# EAGLE design mphase (EAGLE 9.6.2)
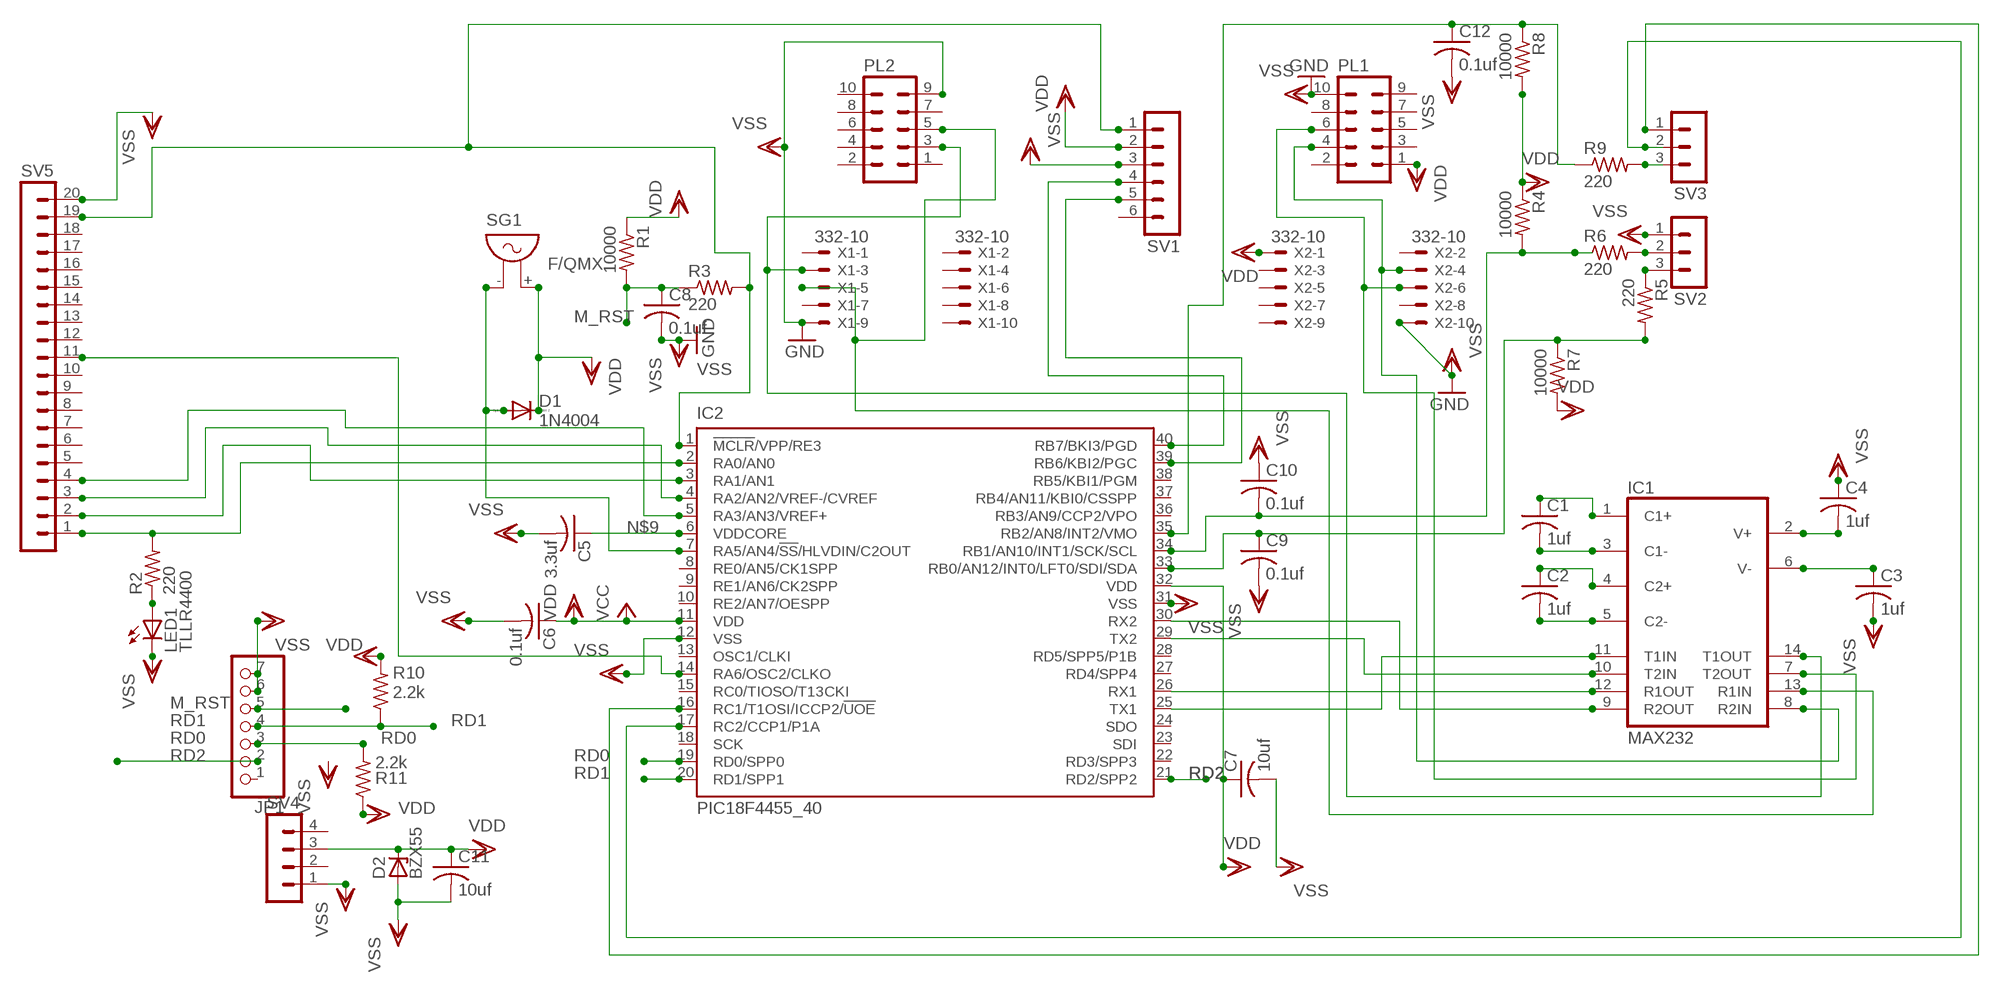
[diagram p0: schematic, sheet 1]

## Parts
C1  1uf  C-USC1206  [C1206]
C2  1uf  C-USC1206  [C1206]
C3  1uf  C-USC1206  [C1206]
C4  1uf  C-USC1206  [C1206]
C5  3.3uf  C-USC1206  [C1206]
C6  0.1uf  C-USC1206  [C1206]
C7  10uf  C-USC1206  [C1206]
C8  0.1uf  C-USC1206  [C1206]
C9  0.1uf  C-USC1206  [C1206]
C10  0.1uf  C-USC1206  [C1206]
C11  10uf  C-USC1206  [C1206]
C12  0.1uf  C-USC1206  [C1206]
D1  1N4004  [DO41-10]
D2  BZX55  [DO35Z10]
IC1  MAX232  [DIL16]
IC2  PIC18F4455_40  [DIL40]
JP1  PINHD-1X7  [1X07]
LED1  TLLR4400  [LED3MM]
PL1  10H  [10H]
PL2  10H  [10H]
R1  10000  R-US_0204/2V  [0204V]
R2  220  R-US_0204/2V  [0204V]
R3  220  R-US_0204/2V  [0204V]
R4  10000  R-US_0204/2V  [0204V]
R5  220  R-US_0204/2V  [0204V]
R6  220  R-US_0204/2V  [0204V]
R7  10000  R-US_0204/2V  [0204V]
R8  10000  R-US_0204/2V  [0204V]
R9  220  R-US_0204/2V  [0204V]
R10  2.2k  R-US_0204/2V  [0204V]
R11  2.2k  R-US_0204/2V  [0204V]
SG1  F/QMX  [F/QMX]
SV1  MA06-1  [MA06-1]
SV2  MA03-1  [MA03-1]
SV3  MA03-1  [MA03-1]
SV4  MA04-1  [MA04-1]
SV5  MA20-1  [MA20-1]
X1  332-10  [332-10]
X2  332-10  [332-10]

## Nets
M_RST: C8.1 JP1.5 R1.2 R3.1
N$1: C1.2 IC1.3(C1-)
N$2: C2.2 IC1.5(C2-)
N$3: C2.1 IC1.4(C2+)
N$4: C1.1 IC1.1(C1+)
N$5: C4.2 IC1.2(V+)
N$6: C3.1 IC1.6(V-)
N$7: D1.A IC2.7(RA5/AN4/!SS!/HLVDIN/C2OUT) SG1.-
N$8: IC2.1(!MCLR!/VPP/RE3) R3.2 SV1.1 SV5.19
N$9: C5.1 IC2.6(VDDCORE)
N$10: IC1.10(T2IN) IC2.29(TX2)
N$11: IC1.11(T1IN) IC2.25(TX1)
N$12: IC1.12(R1OUT) IC2.26(RX1)
N$13: IC1.9(R2OUT) IC2.30(RX2)
N$15: IC2.2(RA0/AN0) R2.2 SV5.1
N$16: IC1.7(T2OUT) PL1.6 X2.6
N$17: IC1.8(R2IN) PL1.4 X2.4
N$18: LED1.A R2.1
N$19: IC1.14(T1OUT) PL2.3 X1.3
N$20: IC1.13(R1IN) PL2.5 X1.5
N$21: C10.2 IC2.34(RB1/AN10/INT1/SCK/SCL) R4.2 R6.1
N$22: C9.1 IC2.33(RB0/AN12/INT0/LFT0/SDI/SDA) R5.2 R7.1
N$23: IC2.3(RA1/AN1) SV5.2
N$24: R6.2 SV2.2
N$25: R5.1 SV2.3
N$26: IC2.4(RA2/AN2/VREF-/CVREF) SV5.3
N$27: IC2.5(RA3/AN3/VREF+) SV5.4
N$28: C12.1 IC2.35(RB2/AN8/INT2/VMO) R8.1 R9.1
N$29: IC2.40(RB7/BKI3/PGD) SV1.4
N$30: IC2.14(RA6/OSC2/CLKO) SV5.11
N$31: R9.2 SV3.3
N$32: IC2.39(RB6/KBI2/PGC) SV1.5
N$33: IC2.16(RC1/T1OSI/ICCP2/!UOE) SV3.1
N$34: IC2.17(RC2/CCP1/P1A) SV3.2
RD0: IC2.19(RD0/SPP0) JP1.3 R11.2
RD1: IC2.20(RD1/SPP1) JP1.4 R10.1
RD2: IC2.21(RD2/SPP2) JP1.2
VCC: C6.1 IC2.11(VDD) ; supply symbol labelled VDD
VDD: C7.1 C11.1 D1.C D2.C IC2.32(VDD) PL1.1 R1.1 R4.1 R7.2 R8.2 R10.2 R11.1 SG1.+ SV1.2 SV4.3 X2.1
VSS: C3.2 C4.1 C5.2 C6.2 C7.2 C8.2 C9.2 C10.1 C11.2 C12.2 D2.A IC2.12(VSS) IC2.31(VSS) JP1.6 JP1.7 LED1.K(C) PL1.10 PL2.9 SV1.3 SV2.1 SV4.1 SV5.20 X1.9 X2.10 ; supply symbol labelled GND
Unconnected: IC2.8(RE0/AN5/CK1SPP) IC2.9(RE1/AN6/CK2SPP) IC2.10(RE2/AN7/OESPP) IC2.13(OSC1/CLKI) IC2.15(RC0/TIOSO/T13CKI) IC2.18(SCK) IC2.22(RD3/SPP3) IC2.23(SDI) IC2.24(SDO) IC2.27(RD4/SPP4) IC2.28(RD5/SPP5/P1B) IC2.36(RB3/AN9/CCP2/VPO) IC2.37(RB4/AN11/KBI0/CSSPP) IC2.38(RB5/KBI1/PGM) JP1.1 PL1.2 PL1.3 PL1.5 PL1.7 PL1.8 PL1.9 PL2.1 PL2.2 PL2.4 PL2.6 PL2.7 PL2.8 PL2.10 SV1.6 SV4.2 SV4.4 SV5.5 SV5.6 SV5.7 SV5.8 SV5.9 SV5.10 SV5.12 SV5.13 SV5.14 SV5.15 SV5.16 SV5.17 SV5.18 X1.1 X1.2 X1.4 X1.6 X1.7 X1.8 X1.10 X2.2 X2.3 X2.5 X2.7 X2.8 X2.9

## Power pins joined to a net without a drawn wire
VCC: IC1.16(VCC)
VSS: IC1.15(GND)

## Library data of the parts
C1-C12 = rcl:C-US: CAPACITOR, American symbol; SPICEPREFIX: C
D1 = diode:1N4004: DIODE general purpose rectifier, 1 A
D2 = diode:BZX55: Z DIODE
IC1 = maxim:MAX232: RS232 TRANSCEIVER; MF: MAXIM; MPN: MAX232ACPE+; OC_FARNELL: 9723773; OC_NEWARK: 68K4544
IC2 = microchip:PIC18F4*_40: USB Microcontrollers with nanoWatt Technology High-Performance, Enhanced Flash, 28/40/44-Pin, Source: http://ww1.microchip.com/downloads/en/devicedoc/39632c.pdf; MF: MICROCHIP; MPN: PIC18F45K80; OC_FARNELL: 9321314; OC_NEWARK: 05K2028
JP1 = pinhead:PINHD-1X7: PIN HEADER
LED1 = led:TLLR4400: Low Current (2mA) LED 3 mm Tinted Diffused Package color RED Source: Data sheet <http://www.farnell.com/datasheets/391100.pdf>; MF: VISHAY SEMICONDUCTOR; OC_FARNELL: 1612437
PL1 PL2 = con-harting-h:10H: CONNECTOR; OC_FARNELL: unknown; OC_NEWARK: unknown
R1-R11 = resistor:R-US_: RESISTOR, American symbol
SG1 = buzzer:F/QMX: BUZZER Source: Buerklin; OC_FARNELL: unknown; OC_NEWARK: unknown
SV1 = con-lstb:MA06-1: PIN HEADER; OC_FARNELL: unknown; OC_NEWARK: unknown
SV2 SV3 = con-lstb:MA03-1: PIN HEADER; OC_FARNELL: unknown; OC_NEWARK: unknown
SV4 = con-lstb:MA04-1: PIN HEADER; OC_FARNELL: unknown; OC_NEWARK: unknown
SV5 = con-lstb:MA20-1: PIN HEADER; OC_FARNELL: unknown; OC_NEWARK: unknown
X1 X2 = con-garry:332-10: 10 Pin - 2mm Dual Row Source: www.mpe-connector.de / garry_shortform_2012.pdf

## Board
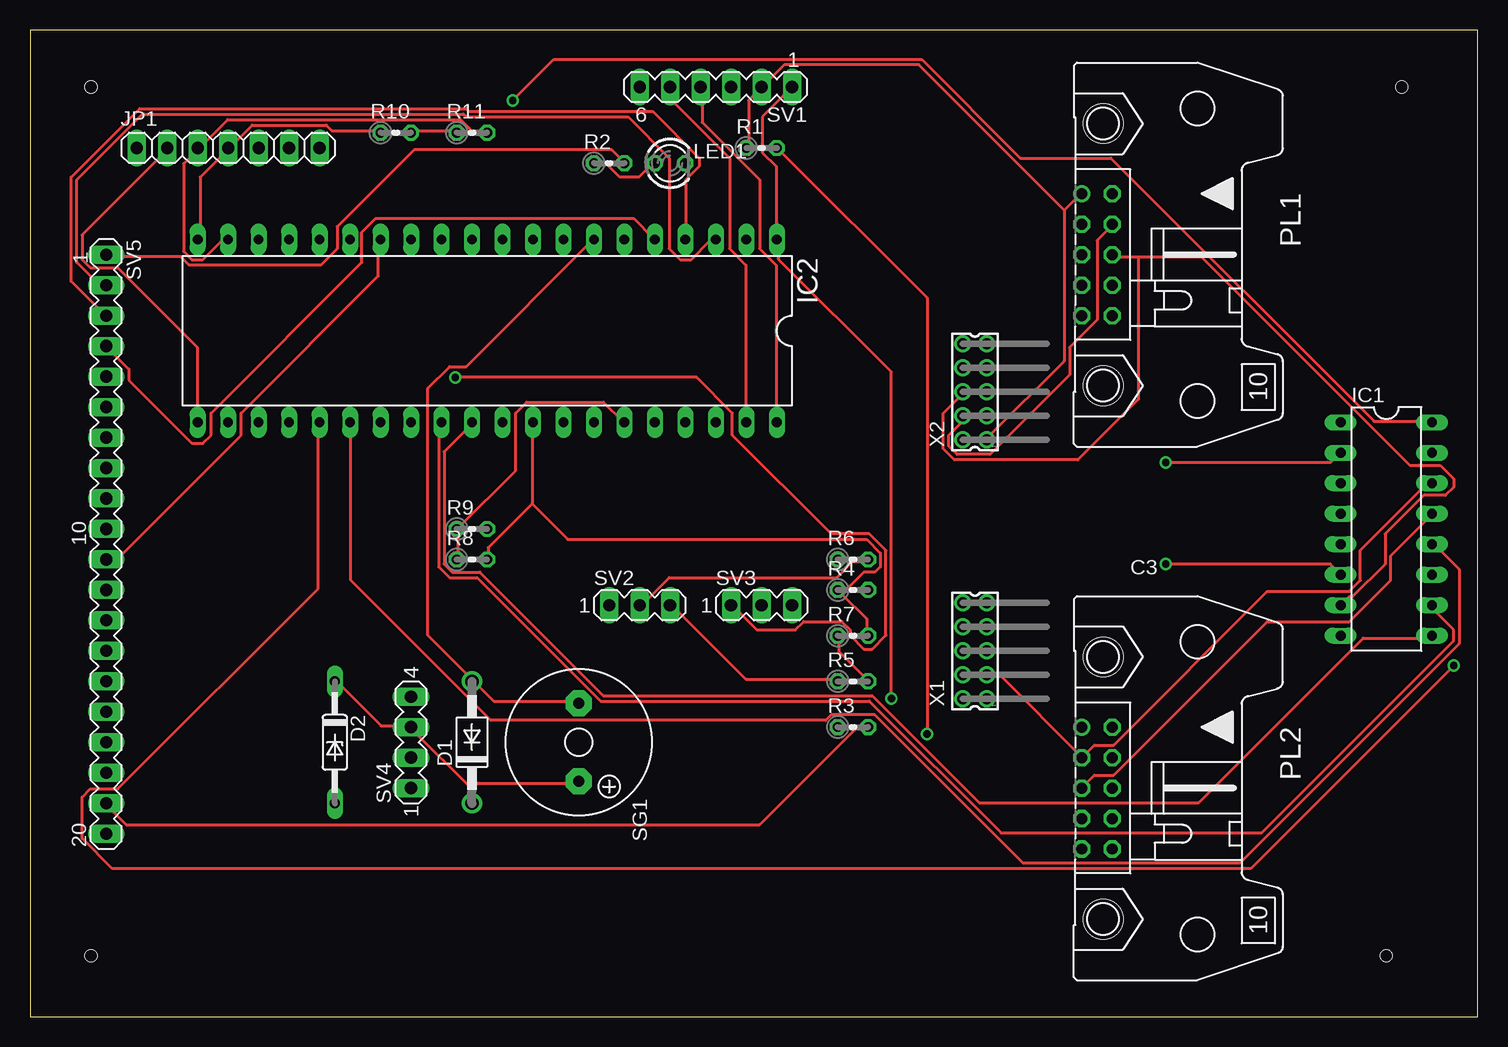
[diagram p1: board, top side]
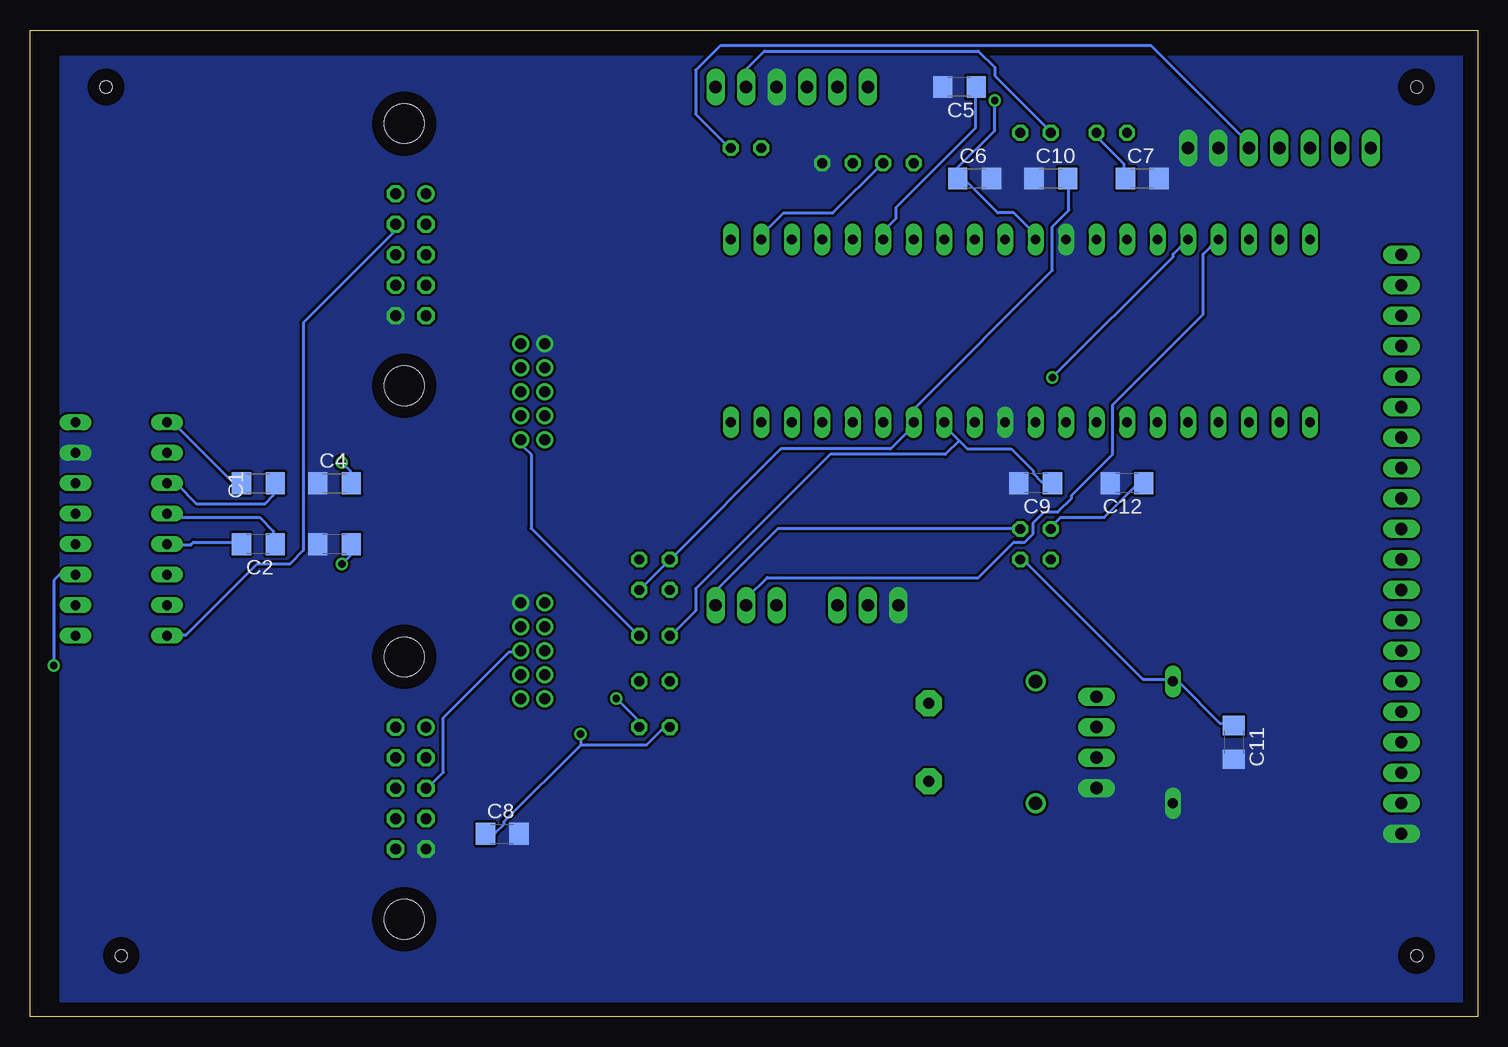
[diagram p2: board, bottom side, seen from below]

Size 120.63 x 82.22 mm. Coordinates in mm from the lower left corner, seen from the top.
Outline: 0,0 120.63,0 120.63,82.22 0,82.22 0,0
Copper layers (1*16): Top 0.035mm / dielectric 1.5mm / Bottom 0.035mm
Design rules "default": minimum track width 10mil, minimum drill 24mil, track to track 8mil, track to pad 8mil, pad to pad 8mil, via to via 8mil, smd to smd 8mil, copper to edge 40mil, drill to drill 8mil, minimum pad ring 10mil, minimum via ring 8mil, stop-mask expansion 4mil, vias tented up to drill 0mil, thermal gap 10mil
Holes 1 mm at 5.08,77.47 5.08,5.08 113.03,5.08 114.3,77.47

### Footprints (pad centres in the part's own frame; a part is rotated, then mirrored left to right if it is on the bottom)
C1206 = smd 1.6 x 1.8: 1 -1.4,0; 2 1.4,0
DO41-10 = drill 1.118: A 5.08,0; C -5.08,0
DO35Z10 = drill 0.813 long: A 5.08,0; C -5.08,0
DIL16 = drill 0.813 long: 1 -8.89,-3.81; 2 -6.35,-3.81; 3 -3.81,-3.81; 4 -1.27,-3.81; 5 1.27,-3.81; 6 3.81,-3.81; 7 6.35,-3.81; 8 8.89,-3.81; 9 8.89,3.81; 10 6.35,3.81; 11 3.81,3.81; 12 1.27,3.81; 13 -1.27,3.81; 14 -3.81,3.81; 15 -6.35,3.81; 16 -8.89,3.81
DIL40 = drill 0.813 long: 1 -24.13,-7.62; 2 -21.59,-7.62; 3 -19.05,-7.62; 4 -16.51,-7.62; 5 -13.97,-7.62; 6 -11.43,-7.62; 7 -8.89,-7.62; 8 -6.35,-7.62; 9 -3.81,-7.62; 10 -1.27,-7.62; 11 1.27,-7.62; 12 3.81,-7.62; 13 6.35,-7.62; 14 8.89,-7.62; 15 11.43,-7.62; 16 13.97,-7.62; 17 16.51,-7.62; 18 19.05,-7.62; 19 21.59,-7.62; 20 24.13,-7.62; 21 24.13,7.62; 22 21.59,7.62; 23 19.05,7.62; 24 16.51,7.62; 25 13.97,7.62; 26 11.43,7.62; 27 8.89,7.62; 28 6.35,7.62; 29 3.81,7.62; 30 1.27,7.62; 31 -1.27,7.62; 32 -3.81,7.62; 33 -6.35,7.62; 34 -8.89,7.62; 35 -11.43,7.62; 36 -13.97,7.62; 37 -16.51,7.62; 38 -19.05,7.62; 39 -21.59,7.62; 40 -24.13,7.62
1X07 = drill 1.016 long: 1 -7.62,0; 2 -5.08,0; 3 -2.54,0; 4 0,0; 5 2.54,0; 6 5.08,0; 7 7.62,0
LED3MM = drill 0.813 octagon: A -1.27,0; K 1.27,0
10H = drill 0.914: 1 -5.08,-1.27 | drill 0.914 octagon: 2 -5.08,1.27; 3 -2.54,-1.27; 4 -2.54,1.27; 5 0,-1.27; 6 0,1.27; 7 2.54,-1.27; 8 2.54,1.27; 9 5.08,-1.27; 10 5.08,1.27 | hole 3.302: -10.922,0.533; 10.922,0.533
0204V = drill 0.813 octagon: 1 -1.27,0; 2 1.27,0
F/QMX = drill 0.914 pad 2.159 octagon: + 3.251,0; - -3.251,0
MA06-1 = drill 1.016 long: 1 -6.35,0; 2 -3.81,0; 3 -1.27,0; 4 1.27,0; 5 3.81,0; 6 6.35,0
MA03-1 = drill 1.016 long: 1 -2.54,0; 2 0,0; 3 2.54,0
MA04-1 = drill 1.016 long: 1 -3.81,0; 2 -1.27,0; 3 1.27,0; 4 3.81,0
MA20-1 = drill 1.016 long: 1 -24.13,0; 2 -21.59,0; 3 -19.05,0; 4 -16.51,0; 5 -13.97,0; 6 -11.43,0; 7 -8.89,0; 8 -6.35,0; 9 -3.81,0; 10 -1.27,0; 11 1.27,0; 12 3.81,0; 13 6.35,0; 14 8.89,0; 15 11.43,0; 16 13.97,0; 17 16.51,0; 18 19.05,0; 19 21.59,0; 20 24.13,0
332-10 = drill 0.9 pad 1.27: 1 -4,-1; 2 -4,1; 3 -2,-1; 4 -2,1; 5 0,-1; 6 0,1; 7 2,-1; 8 2,1; 9 4,-1; 10 4,1

### Placement (x,y rotation side)
C1  101.6,44.45 0 bottom
C2  101.6,39.37 180 bottom
C3  95.25,39.37 180 bottom
C4  95.25,44.45 0 bottom
C5  43.18,77.47 180 bottom
C6  41.91,69.85 0 bottom
C7  27.94,69.85 0 bottom
C8  81.28,15.24 0 bottom
C9  36.83,44.45 180 bottom
C10  35.56,69.85 0 bottom
C11  20.32,22.86 270 bottom
C12  29.21,44.45 180 bottom
D1  36.83,22.86 90 top
D2  25.4,22.86 270 top
IC1  113.03,40.64 270 top
IC2  38.1,57.15 180 top
JP1  16.51,72.39 0 top
LED1  53.34,71.12 0 top
PL1  88.9,63.5 270 top
PL2  88.9,19.05 270 top
R1  60.96,72.39 0 top
R2  48.26,71.12 0 top
R3  68.58,24.13 0 top
R4  68.58,35.56 0 top
R5  68.58,27.94 0 top
R6  68.58,38.1 0 top
R7  68.58,31.75 0 top
R8  36.83,38.1 0 top
R9  36.83,40.64 0 top
R10  30.48,73.66 0 top
R11  36.83,73.66 0 top
SG1  45.72,22.86 270 top
SV1  57.15,77.47 180 top
SV2  50.8,34.29 0 top
SV3  60.96,34.29 0 top
SV4  31.75,22.86 90 top
SV5  6.35,39.37 270 top
X1  78.74,30.48 90 top
X2  78.74,52.07 90 top

### Tracks (layer width: path | path; a pad name or v marks a point on that pad's centre or on a via)
M_RST  (via drill 0.61)
  Top 0.254: v74.75,23.55 74.75,59.89 62.41,72.24 R1.2
  Bottom 0.254: 74.75,22.63 81.15,16.23 81.15,16 81.84,15.32 82.53,15.32 C8.1 | 74.75,22.63 69.27,22.63 67.89,24 67.44,24 R3.1 | R1.2 62.41,72.47 65.15,75.21 65.15,78.87 63.09,80.92 27.2,80.92 19.2,72.92 19.2,72.47 JP1.5 | v74.75,23.55 74.75,22.63
N$1
  Bottom 0.254: C1.2 100.36,44.35 100.36,43.43 101.04,42.75 106.76,42.75 108.36,44.35 109.04,44.35 IC1.3
N$2
  Bottom 0.254: C2.2 103.1,39.55 106.98,39.55 107.21,39.32 109.04,39.32 IC1.5
N$3
  Bottom 0.254: C2.1 100.36,39.55 100.36,40.46 101.5,41.6 108.81,41.6 109.04,41.83 IC1.4
N$4
  Bottom 0.254: C1.1 103.1,44.58 103.78,44.58 108.58,49.38 109.04,49.38 IC1.1
N$5  (via drill 0.61)
  Top 0.254: v94.64,46.18 108.36,46.18 109.04,46.86 IC1.2
  Bottom 0.254: v94.64,46.18 93.95,45.49 93.95,44.58 C4.2
N$6  (via drill 0.61)
  Top 0.254: v94.64,37.72 108.36,37.72 109.04,37.03 IC1.6
  Bottom 0.254: v94.64,37.72 93.95,38.41 93.95,39.32 C3.1
N$7
  Top 0.254: IC2.7 46.86,64.69 36.35,54.18 34.98,54.18 33.15,52.35 33.15,31.77 36.8,28.12 D1.A 37.03,27.89 38.63,26.29 45.72,26.29 SG1.-
N$8  (via drill 0.61)
  Top 0.254: SV1.1 63.32,77.27 61.04,74.98 61.04,72.01 62.18,70.87 62.18,64.92 IC2.1 62.41,64.69 62.41,63.09 71.78,53.72 v71.78,26.52 | R3.2 69.72,24 68.81,24 60.81,16 8,16 6.4,17.6 SV5.19
  Bottom 0.254: v71.78,26.52 69.95,24.69 69.95,24.23 R3.2
N$9
  Bottom 0.254: C5.1 41.83,77.27 41.83,74.07 48.46,67.44 48.46,66.52 49.38,65.61 49.38,64.92 IC2.6
N$10
  Top 0.254: IC1.10 117.04,34.29 117.04,33.83 118.64,32.23 118.64,31.32 102.64,15.32 80.92,15.32 69.95,26.29 47.55,26.29 37.26,36.58 34.98,36.58 34.06,37.49 34.06,49.15 34.29,49.38 IC2.29
N$11  (via drill 0.61)
  Top 0.254: v118.64,29.26 101.73,12.34 6.86,12.34 4.34,14.86 4.34,18.29 5.03,18.97 7.32,18.97 24,35.66 24,49.38 IC2.25
  Bottom 0.254: v118.64,29.26 118.64,36.35 118.19,36.8 117.04,36.8 IC1.11
N$12
  Top 0.254: IC2.26 26.75,49.38 26.75,36.35 38.41,24.69 66.29,24.69 66.75,25.15 70.41,25.15 82.75,12.8 100.81,12.8 119.1,31.09 119.1,37.26 117.04,39.32 IC1.12
N$13
  Top 0.254: IC1.9 116.81,31.55 111.1,31.55 97.38,17.83 79.1,17.83 70.18,26.75 47.78,26.75 37.49,37.03 35.2,37.03 34.52,37.72 34.52,47.09 36.8,49.38 IC2.30
N$15
  Top 0.254: SV5.1 6.4,63.32 12.57,63.32 13.26,62.64 24.23,62.64 25.6,64.01 25.6,65.84 32,72.24 48.46,72.24 49.38,71.32 R2.2
  Bottom 0.254: R2.2 49.61,71.09 53.72,66.98 57.84,66.98 59.89,64.92 IC2.2
N$16
  Top 0.254: 92.35,63.32 90.3,63.32 PL1.6 | 92.35,63.32 97.61,63.32 114.99,45.95 117.5,45.95 118.64,44.81 118.64,44.12 117.96,43.43 116.13,43.43 112.93,40.23 112.93,37.72 110.19,34.98 109.96,34.98 109.27,34.29 IC1.7 | 92.35,63.32 92.35,51.44 87.33,46.41 77.04,46.41 76.12,47.32 76.12,50.29 77.72,51.89 X2.6
N$17
  Top 0.254: X2.4 77.72,50.06 77.72,49.61 76.58,48.46 76.58,47.55 77.27,46.86 80.01,46.86 86.64,53.49 86.64,55.78 88.92,58.06 88.92,64.69 90.07,65.84 PL1.4
  Bottom 0.254: IC1.8 109.04,31.77 107.67,31.77 101.73,37.72 98.98,37.72 97.84,38.86 97.84,57.84 90.3,65.38 90.3,65.84 PL1.4
N$18
  Top 0.254: R2.1 47.09,71.09 48.01,71.09 49.15,69.95 50.75,69.95 51.89,71.09 LED1.A
N$19
  Top 0.254: IC1.14 116.81,44.35 116.36,44.35 110.87,38.86 110.87,36.35 109.96,35.43 103.1,35.43 90.3,22.63 88.7,22.63 87.78,21.72 PL2.3 87.55,21.72 80.92,28.35 79.78,28.35 X1.3
N$20
  Top 0.254: PL2.5 88.7,20.12 90.3,20.12 103.1,32.92 109.96,32.92 113.39,36.35 113.39,38.41 116.81,41.83 IC1.13
  Bottom 0.254: X1.5 79.78,30.4 80.7,30.4 86.18,24.92 86.18,20.34 87.55,18.97 PL2.5
N$21
  Bottom 0.254: R4.2 69.72,35.66 67.44,37.95 R6.1 67.21,38.18 58.06,47.32 48.92,47.32 46.86,49.38 IC2.34 46.86,49.61 46.86,50.75 35.43,62.18 35.43,65.84 34.06,67.21 34.06,69.72 C10.2
N$22
  Top 0.254: R7.1 67.44,31.55 67.44,30.4 69.72,28.12 R5.2
  Bottom 0.254: 43.2,48.01 44.58,49.38 IC2.33 | 43.2,48.01 42.52,47.32 38.86,47.32 37.03,45.49 37.03,45.26 36.35,44.58 35.43,44.58 C9.1 | 43.2,48.01 44.35,46.86 53.95,46.86 65.15,35.66 65.15,33.83 67.21,31.77 R7.1
N$23
  Top 0.254: IC2.3 57.15,64.69 56.69,64.69 55.09,63.09 54.18,63.09 53.26,64.01 53.26,71.55 49.84,74.98 36.35,74.98 36.12,75.21 9.37,75.21 3.89,69.72 3.89,62.87 5.71,61.04 6.17,61.04 SV5.2
N$24
  Top 0.254: R6.2 69.72,37.95 68.58,37.95 67.21,36.58 53.26,36.58 50.98,34.29 SV2.2
N$25
  Top 0.254: R5.1 67.21,28.12 59.66,28.12 53.49,34.29 SV2.3
N$26
  Top 0.254: IC2.4 54.63,64.92 54.63,69.72 55.78,70.87 55.78,71.55 51.89,75.44 36.58,75.44 36.35,75.67 9.14,75.67 3.43,69.95 3.43,61.27 6.17,58.52 SV5.3
N$27
  Top 0.254: IC2.5 51.89,64.92 50.29,66.52 28.8,66.52 27.66,65.38 27.66,62.87 15.09,50.29 15.09,48.46 14.4,47.78 13.49,47.78 8.23,53.03 8.23,53.95 6.4,55.78 SV5.4
N$28
  Top 0.254: R8.1 35.66,38.18 35.66,40.46 R9.1 35.66,40.69 40.46,45.49 40.46,50.29 41.38,51.21 47.78,51.21 49.38,49.61 IC2.35
  Bottom 0.254: C12.1 27.89,44.35 28.35,44.35 31.09,41.6 34.75,41.6 35.66,40.69 R9.1
N$29
  Top 0.254: IC2.40 62.18,49.61 62.18,62.64 60.81,64.01 60.81,69.72 56.01,74.52 56.01,77.27 SV1.4
N$30
  Top 0.254: IC2.14 29.03,64.69 29.03,61.72 17.6,50.29 17.6,48.46 7.32,38.18 6.4,38.18 SV5.11
N$31
  Bottom 0.254: R9.2 38.18,40.69 58.29,40.69 63.32,35.66 63.32,34.29 SV3.3
N$32
  Top 0.254: IC2.39 59.66,49.61 59.66,62.64 58.29,64.01 58.29,71.55 53.49,76.35 53.49,77.27 SV1.5
N$33  (via drill 0.61)
  Top 0.254: v35.43,53.26 55.55,53.26 58.52,50.29 58.52,48.46 66.75,40.23 69.95,40.23 71.32,38.86 71.32,31.77 70.18,30.63 69.49,30.63 68.35,31.77 68.35,32.23 67.67,32.92 64.47,32.92 63.78,32.23 60.58,32.23 58.52,34.29 SV3.1
  Bottom 0.254: v35.43,53.26 25.38,63.32 25.38,63.55 24.23,64.69 IC2.16
N$34
  Bottom 0.254: IC2.17 21.72,64.69 22.86,63.55 22.86,58.52 30.4,50.98 30.4,46.86 33.83,43.43 33.83,43.2 34.98,42.06 36.12,42.06 37.03,41.15 37.03,40.23 37.72,39.55 38.63,39.55 41.6,36.58 59.21,36.58 60.81,34.98 60.81,34.29 SV3.2
RD0
  Top 0.254: IC2.19 16.46,64.69 16,64.69 14.4,63.09 13.49,63.09 12.8,63.78 12.8,71.09 13.95,72.24 JP1.3 14.17,72.47 16.46,74.75 35.89,74.75 36.8,73.84 37.95,73.84 R11.2
RD1
  Top 0.254: IC2.20 14.17,64.92 14.17,69.95 16.46,72.24 JP1.4 16.69,72.47 18.52,74.3 24.69,74.3 25.15,73.84 29.03,73.84 R10.1
RD2
  Top 0.254: IC2.21 13.95,49.61 13.95,55.78 7.32,62.41 5.03,62.41 4.34,63.09 4.34,65.15 11.43,72.24 JP1.2
VCC  (via drill 0.61)
  Top 0.254: v40.23,76.35 43.66,79.78 74.3,79.78 82.53,71.55 90.07,71.55 112.01,49.61 116.81,49.61 IC1.16
  Bottom 0.254: IC2.11 37.03,64.92 37.03,65.38 38.63,66.98 40.01,66.98 42.75,69.72 43.2,69.72 C6.1 43.43,69.95 43.43,70.64 40.23,73.84 v40.23,76.35
VDD
  Top 0.254: D2.C 25.6,27.89 29.26,24.23 31.55,24.23 SV4.3 31.77,24 36.8,18.97 | 36.8,18.97 36.8,17.83 D1.C | 36.8,18.97 37.26,19.43 45.72,19.43 SG1.+ | 67.67,35.2 R4.1 67.44,35.43 | 67.67,35.2 69.72,33.15 69.72,31.77 R7.2 | 41.83,42.75 38.18,39.09 38.18,38.18 R8.2 | 41.83,42.75 41.83,49.38 IC2.32 | 67.67,35.2 69.49,37.03 70.41,37.03 70.87,37.49 70.87,38.63 69.72,39.78 44.81,39.78 41.83,42.75 | R11.1 35.43,73.84 31.77,73.84 R10.2 | R1.1 59.89,72.47 59.89,76.35 60.81,77.27 SV1.2 61.04,77.5 62.87,79.32 74.07,79.32 86.18,67.21 | 86.18,67.21 86.18,54.63 79.78,48.23 X2.1 | 86.18,67.21 87.55,68.58 PL1.1
  Bottom 0.254: C11.1 20.34,24.46 21.49,24.46 24.92,27.89 25.38,27.89 D2.C 25.6,28.12 27.89,28.12 37.95,38.18 R8.2 | C7.1 29.49,69.95 29.49,71.09 31.55,73.15 31.55,73.61 R10.2 | R11.1 35.66,73.84 40.23,78.41 40.23,79.1 41.6,80.47 59.44,80.47 61.04,78.87 61.04,77.5 SV1.2 | R7.2 69.95,31.77 78.87,40.69 78.87,46.86 79.55,47.55 79.55,48.01 X2.1
VSS
  pour Bottom (no thermals): 1.27,80.01 118.11,80.01 118.11,1.27 1.27,1.27